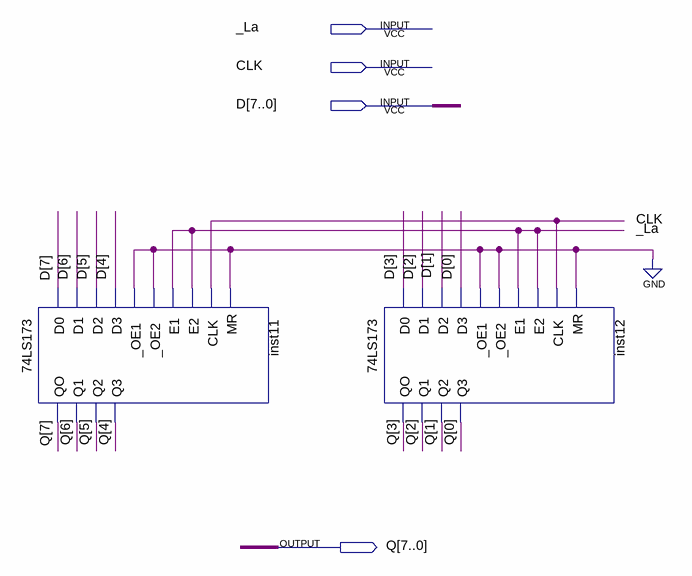
[diagram p0: schematic sheet]
// Quartus schematic Registrador_de_Saida.bdf as structural Verilog: 2 symbols, 4 pins
module Registrador_de_Saida (
  input  _La,
  input  CLK,
  input  [7:0] D,
  output [7:0] Q
);

  \74LS173  inst11 (
    .D0(D[7]), .D1(D[6]), .D2(D[5]), .D3(D[4]), ._OE1(1'b0), ._OE2(1'b0), .E1(_La), .E2(_La), .CLK(CLK),
    .MR(1'b0), .QO(Q[7]), .Q1(Q[6]), .Q2(Q[5]), .Q3(Q[4]));
  \74LS173  inst12 (
    .D0(D[3]), .D1(D[2]), .D2(D[1]), .D3(D[0]), ._OE1(1'b0), ._OE2(1'b0), .E1(_La), .E2(_La), .CLK(CLK),
    .MR(1'b0), .QO(Q[3]), .Q1(Q[2]), .Q2(Q[1]), .Q3(Q[0]));
endmodule
